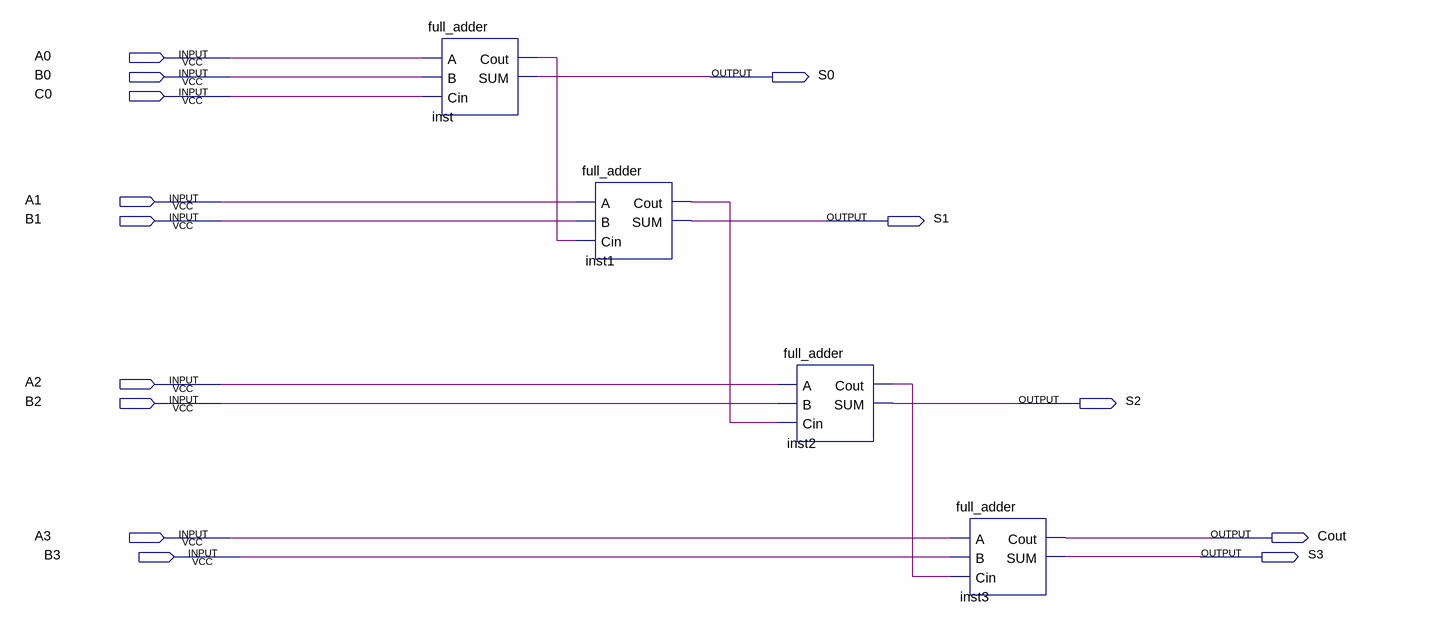
[diagram p0: schematic sheet]
// Quartus schematic ripple_carry_adder.bdf as structural Verilog: 4 symbols, 14 pins
module ripple_carry_adder (
  input  A0,
  input  B0,
  input  C0,
  input  A1,
  input  B1,
  input  A2,
  input  B2,
  input  A3,
  input  B3,
  output S0,
  output S1,
  output S2,
  output Cout,
  output S3
);

  wire inst1_cout, inst2_cout, inst_cout;

  full_adder inst (.A(A0), .B(B0), .Cin(C0), .Cout(inst_cout), .SUM(S0));
  full_adder inst1 (.A(A1), .B(B1), .Cin(inst_cout), .Cout(inst1_cout), .SUM(S1));
  full_adder inst2 (.A(A2), .B(B2), .Cin(inst1_cout), .Cout(inst2_cout), .SUM(S2));
  full_adder inst3 (.A(A3), .B(B3), .Cin(inst2_cout), .Cout(Cout), .SUM(S3));
endmodule
